# Altium project CircuitLamp.PrjPcb
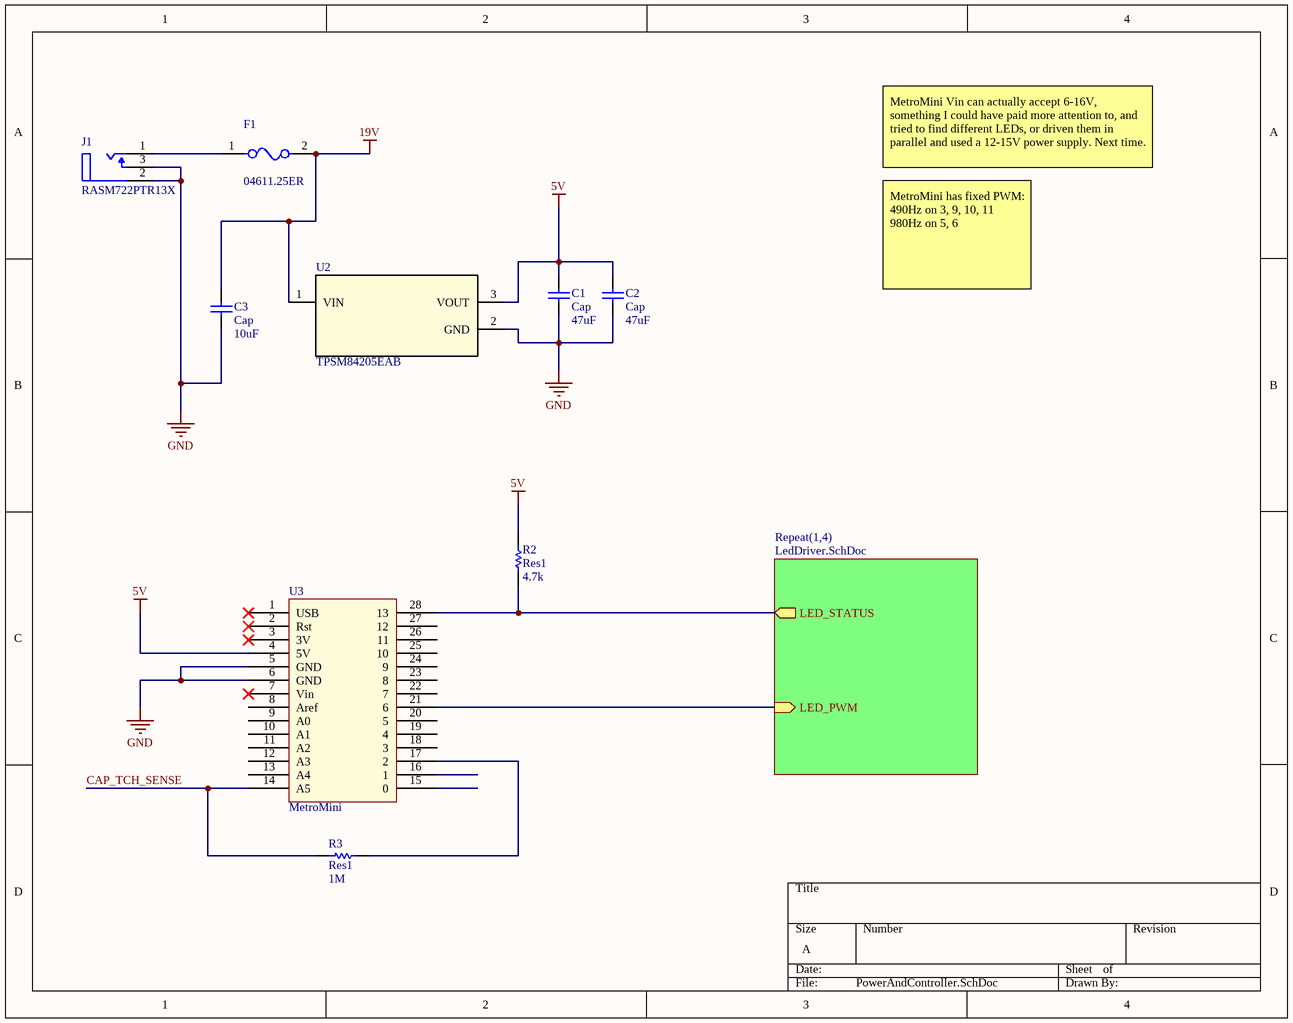
[diagram p0: PowerAndController.SchDoc]
2 sheets, 19 parts. Net scope: hierarchical (ports join the sheet entries above them; power ports are global).
Board files: SinglePanelOpaque.PcbDoc, Panelized.PcbDoc, mousebite.PcbDoc, mousebiteAngled.PcbDoc, SinglePanelTransparent.PcbDoc
Sheets:
  PowerAndController.SchDoc
    Repeat(1,4) = LedDriver.SchDoc

## Sheet PowerAndController.SchDoc
size A

### Parts
C1  Cap  value 47uF  [RAD-0.3]
C2  Cap  value 47uF  [RAD-0.3]
C3  Cap  value 10uF  [RAD-0.3]
F1  04611.25ER  [FP-0461-MFG]
J1  RASM722PTR13X  [FP-RASM722PTR13X-MFG]
R2  Res1  value 4.7k  [AXIAL-0.3]
R3  Res1  value 1M  [AXIAL-0.3]
U2  TPSM84205EAB  [EAB0003A]
U3  MetroMini

### Sub-sheets
Repeat(1,4) = LedDriver.SchDoc: LED_STATUS (out), LED_PWM (in)

### Nets
5V: C1.2 C2.2 R2.2 U2.3(VOUT) U3.4(5V)
19V: C3.2 F1.2 U2.1(VIN)
GND: C1.1 C2.1 C3.1 J1.2(SLEEVE_TERMINAL) J1.3(SHUNT_TERMINAL) U2.2(GND) U3.5(GND) U3.6(GND)
CAP_TCH_SENSE: R3.1 U3.14(A5)
NetF1_1: F1.1 J1.1(TIP_TERMINAL(CENTER_PIN))
NetR2_1: R2.1 U3.28(13) ; sheet Repeat(1,4)/LED_STATUS
NetR3_2: R3.2 U3.17(2)
NetU1_2: U3.21(6) ; sheet Repeat(1,4)/LED_PWM

Not connected (* = marked no-connect by the designer): U3 1(USB)* 2(Rst)* 3(3V)* 7(Vin)* 8(Aref) 9(A0) 10(A1) 11(A2) 12(A3) 13(A4) 15(0) 16(1) 18(3) 19(4) 20(5) 22(7) 23(8) 24(9) 25(10) 26(11) 27(12)

### Notes on the sheet
- MetroMini Vin can actually accept 6-16V, something I could have paid more attention to, and tried to find different LEDs, or driven them in parallel and used a 12-15V power supply. Next time.
- MetroMini has fixed PWM:
  490Hz on 3, 9, 10, 11
  980Hz on 5, 6

### Library data of the parts
C1-C3 = Cap: Capacitor; Published: 8-Jun-2000; LatestRevisionDate: 17-Jul-2002; LatestRevisionNote: Re-released for DXP Platform.; PackageReference: RAD-0.3; Publisher: Altium Limited; PackageDescription: Radial Cap, Thru-Hole; 2 Leads; 0.3 in Pin Spacing
F1 = CMP-08605-000011-1: FUSE BRD MNT 1.25A 600VAC/80VDC; Manufacturer: Littelfuse Inc; Resistance: 0.104Ω; Fuse Interrupt Ac Current: 60A; Max Fuse Dc Voltage: 80V; Fuse I2T: 16.5A2Sec; Value: 0.104Ω; Voltage Rating: 600V; Fuse Interrupt Dc Current: 100A; Fuse Blow Speed: Slow; Manufacturer Part Number: 04611.25ER; Temperature: -55°C to +125°C; Automotive: No; Temperature Range High: +125°C; Height: 3.12mm; Category: Fuse; Temperature Range Low: -55°C; ComponentLink2Description: Datasheet; Mouser Description: Surface Mount Fuses 600V 1.25A Telecom Fuse; Device Class L3: unset; ComponentLink2URL: https://www.littelfuse.com/~/media/electronics/datasheets/fuses/littelfuse_fuse_461_datasheet.pdf.pdf; Device Class L1: Circuit Protection; Digikey Description: FUSE BRD MNT 1.25A 600VAC/80VDC; Package: 0461; Max Fuse Ac Voltage: 600V; Device Class L2: Fuses; Lead Free: Yes; Ipc Land Pattern Name: CAPC1010312X312; Octopart: https://octopart.com/04611.25er-littelfuse-566039; RoHS: TRUE; Fuse Current: 1.25A
J1 = CMP-47995-000002-1: CONN PWR JACK 2.1X5.5MM SOLDER; Shielding: Unshielded; Gender: Male; Current Rating: 5A; Termination: Solder; Contact Material: Copper Alloy; Package Quantity: 120; Case/Package: SMD/SMT; Contact Plating: Tin; Connector Type: Jack; Housing Material: Thermoplastic; Mount: Surface Mount; Housing Color: Black; Color: Black
R2 R3 = Res1: Resistor; Published: 8-Jun-2000; LatestRevisionDate: 17-Jul-2002; LatestRevisionNote: Re-released for DXP Platform.; PackageReference: AXIAL-0.3; Publisher: Altium Limited; PackageDescription: Axial Device, Thru-Hole; 2 Leads; 0.3 in Pin Spacing
U2 = TPSM84205EAB: No Description Available; PartNumber: TPSM84205EABT; Manufacturer: Texas Instruments; RefDes: RefDes; Type: DEV; Value: Value; Copyright: Copyright (C) 2018 Accelerated Designs. All rights reserved

## Sheet LedDriver.SchDoc
size A
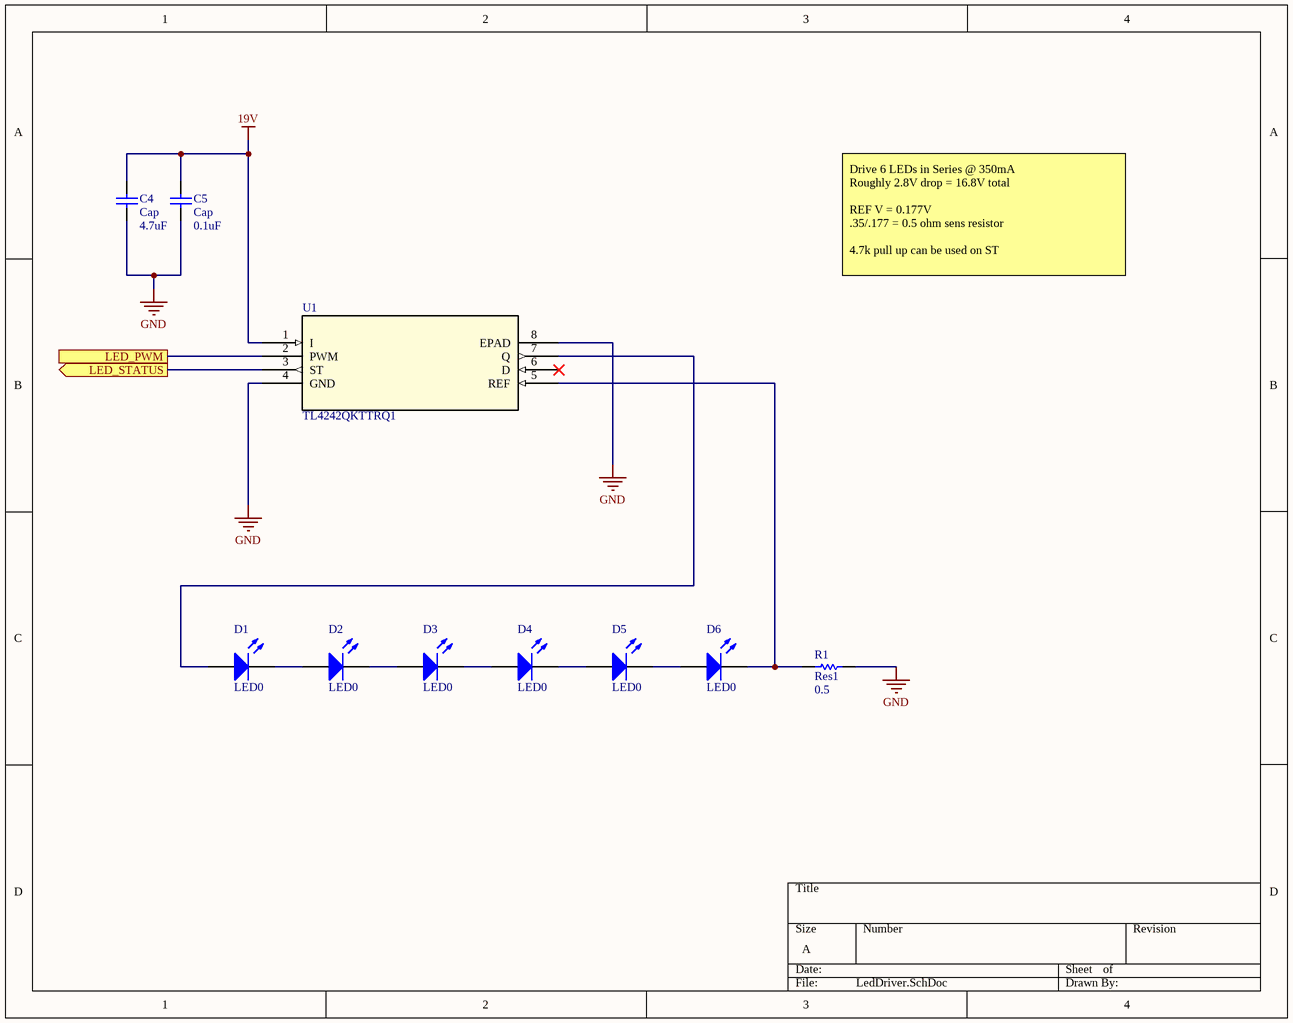
[diagram p1: LedDriver.SchDoc]

### Parts
C4  Cap  value 4.7uF  [RAD-0.3]
C5  Cap  value 0.1uF  [RAD-0.3]
D1  LED0  [LED-0]
D2  LED0  [LED-0]
D3  LED0  [LED-0]
D4  LED0  [LED-0]
D5  LED0  [LED-0]
D6  LED0  [LED-0]
R1  Res1  value 0.5  [AXIAL-0.3]
U1  TL4242QKTTRQ1  [KTT7]

### Ports
LED_PWM, LED_STATUS (out)

### Nets
19V: C4.2 C5.2 U1.1(I)
GND: C4.1 C5.1 R1.2 U1.4(GND) U1.8(EPAD)
NetD1_1: D1.1(A) U1.7(Q)
NetD1_2: D1.2(K) D2.1(A)
NetD2_2: D2.2(K) D3.1(A)
NetD3_2: D3.2(K) D4.1(A)
NetD4_2: D4.2(K) D5.1(A)
NetD5_2: D5.2(K) D6.1(A)
NetD6_2: D6.2(K) R1.1 U1.5(REF)
NetR2_1: U1.3(ST) ; port LED_STATUS
NetU1_2: U1.2(PWM) ; port LED_PWM

Not connected (* = marked no-connect by the designer): U1 6(D)*

### Notes on the sheet
- Drive 6 LEDs in Series @ 350mA
  Roughly 2.8V drop = 16.8V total
  REF V = 0.177V
  .35/.177 = 0.5 ohm sens resistor
  4.7k pull up can be used on ST

### Library data of the parts
C4 C5 = Cap: Capacitor; Published: 8-Jun-2000; LatestRevisionDate: 17-Jul-2002; LatestRevisionNote: Re-released for DXP Platform.; PackageReference: RAD-0.3; Publisher: Altium Limited; PackageDescription: Radial Cap, Thru-Hole; 2 Leads; 0.3 in Pin Spacing
D1-D6 = LED0: Typical INFRARED GaAs LED; Published: 8-Jun-2000; LatestRevisionDate: 08-Jul-2005; LatestRevisionNote: Mech Layer 1 removed.; PackageReference: LED-0; Publisher: Altium Limited; PackageDescription: LED; 2 Leads
R1 = Res1: Resistor; Published: 8-Jun-2000; LatestRevisionDate: 17-Jul-2002; LatestRevisionNote: Re-released for DXP Platform.; PackageReference: AXIAL-0.3; Publisher: Altium Limited; PackageDescription: Axial Device, Thru-Hole; 2 Leads; 0.3 in Pin Spacing
U1 = TL4242QKTTRQ1: Automotive Catalog Adjustable LED Driver; GENERIC_PART_NUMBER: TL4242-Q1; Vendor: Texas Instruments; PACKAGE_DESIGNATOR: KTT; PIN_COUNT: 7; INDUSTRY_STD_PKG_TYPE: DDPAK/TO-263; Manufacturer_Part_Number: TL4242QKTTRQ1; FAMILY_NAME: LED DRIVER; Datasheet_URL: http://www.ti.com/lit/gpn/TL4242-Q1; Manufacturer: Texas Instruments; Copyright: Copyright (C) 2018 Accelerated Designs. All rights reserved; RefDes: RefDes; Type: DEV

## Nets that join several sheets
19V: PowerAndController (C3.2 F1.2 U2.1), LedDriver (C4.2 C5.2 U1.1)
GND: PowerAndController (8 pins), LedDriver (5 pins)
NetR2_1: PowerAndController (R2.1 U3.28), LedDriver (U1.3)
NetU1_2: PowerAndController (U3.21), LedDriver (U1.2)